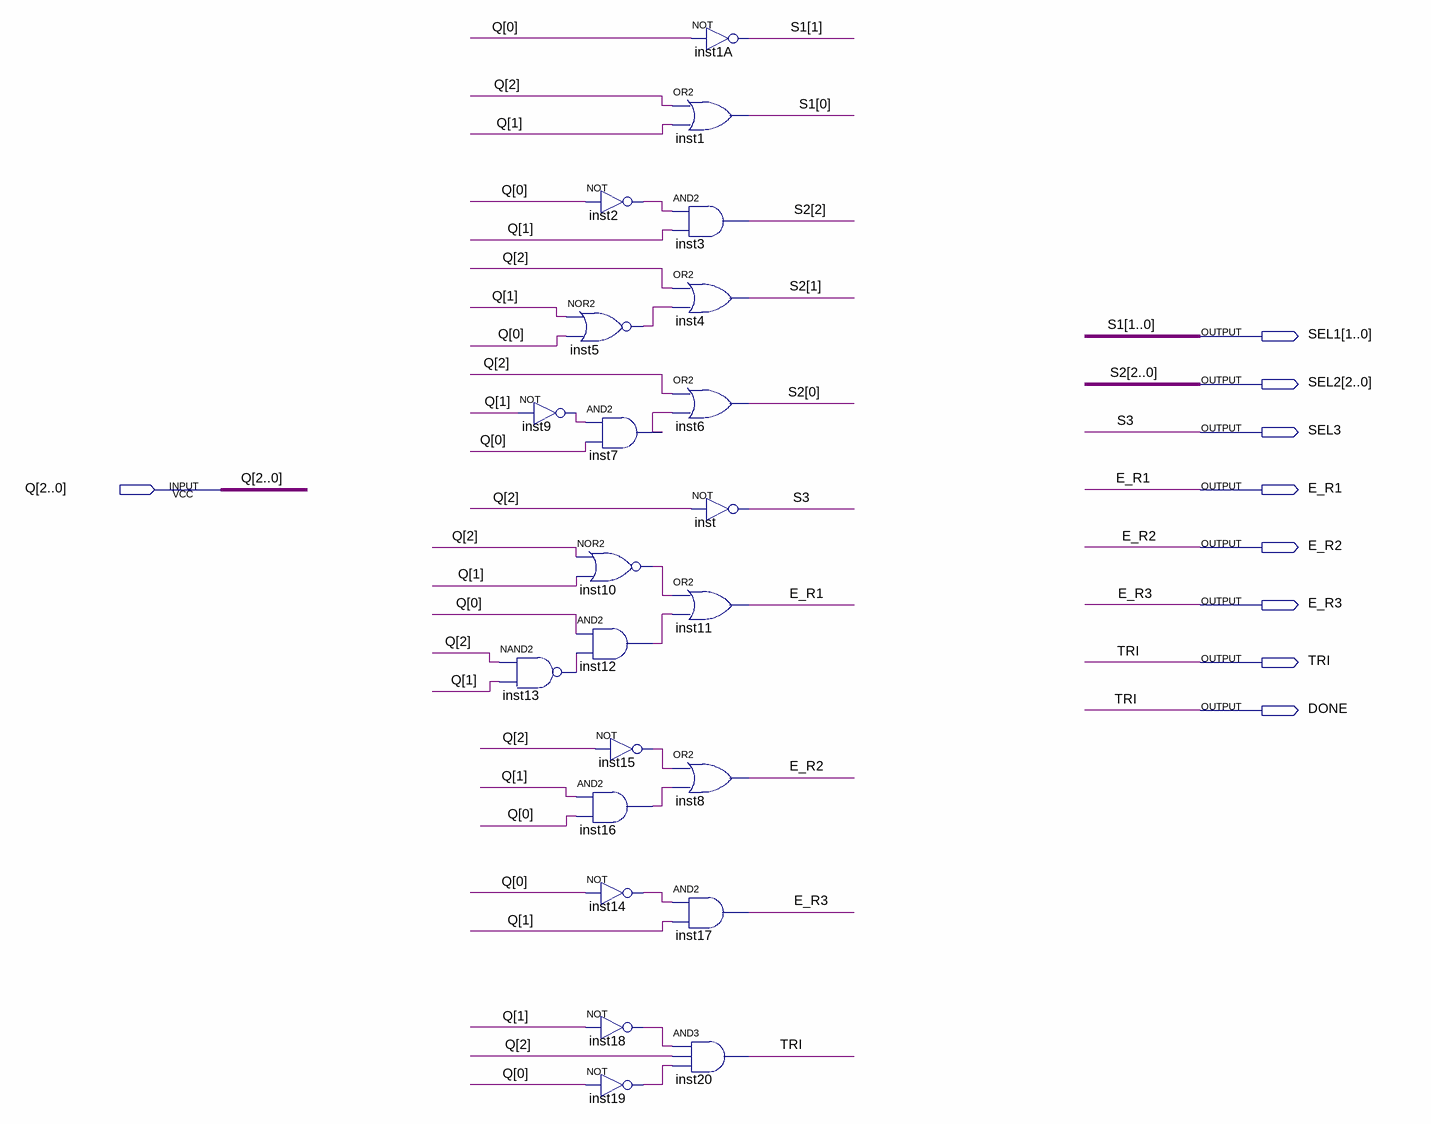
[diagram p0: schematic sheet]
// Quartus schematic OUTPUT.bdf as structural Verilog: 22 symbols, 9 pins
module OUTPUT (
  input  [2:0] Q,
  output [1:0] SEL1,
  output [2:0] SEL2,
  output SEL3,
  output E_R1,
  output E_R2,
  output E_R3,
  output TRI,
  output DONE
);

  wire inst2_out, inst5_out, inst7_out, inst9_out, inst10_out, inst12_out, inst13_out, inst14_out,
       inst15_out, inst16_out, inst18_out, inst19_out;

  not inst9 (inst9_out, Q[1]);
  nand inst13 (inst13_out, Q[2], Q[1]);
  not inst2 (inst2_out, Q[0]);
  nor inst5 (inst5_out, Q[1], Q[0]);
  and inst7 (inst7_out, inst9_out, Q[0]);
  nor inst10 (inst10_out, Q[2], Q[1]);
  and inst12 (inst12_out, Q[0], inst13_out);
  not inst15 (inst15_out, Q[2]);
  and inst16 (inst16_out, Q[1], Q[0]);
  not inst14 (inst14_out, Q[0]);
  not inst18 (inst18_out, Q[1]);
  not inst19 (inst19_out, Q[0]);
  or inst1 (SEL1[0], Q[2], Q[1]);
  and inst3 (SEL2[2], inst2_out, Q[1]);
  or inst4 (SEL2[1], Q[2], inst5_out);
  or inst6 (SEL2[0], Q[2], inst7_out);
  or inst11 (E_R1, inst10_out, inst12_out);
  or inst8 (E_R2, inst15_out, inst16_out);
  and inst17 (E_R3, inst14_out, Q[1]);
  and inst20 (DONE, inst18_out, Q[2], inst19_out);
  not inst1A (SEL1[1], Q[0]);
  not inst (SEL3, Q[2]);

  assign TRI = DONE;

  // Other names for the same wires on the sheet: S1[1:0] = SEL1; S2[2:0] = SEL2; S3 = SEL3
endmodule
